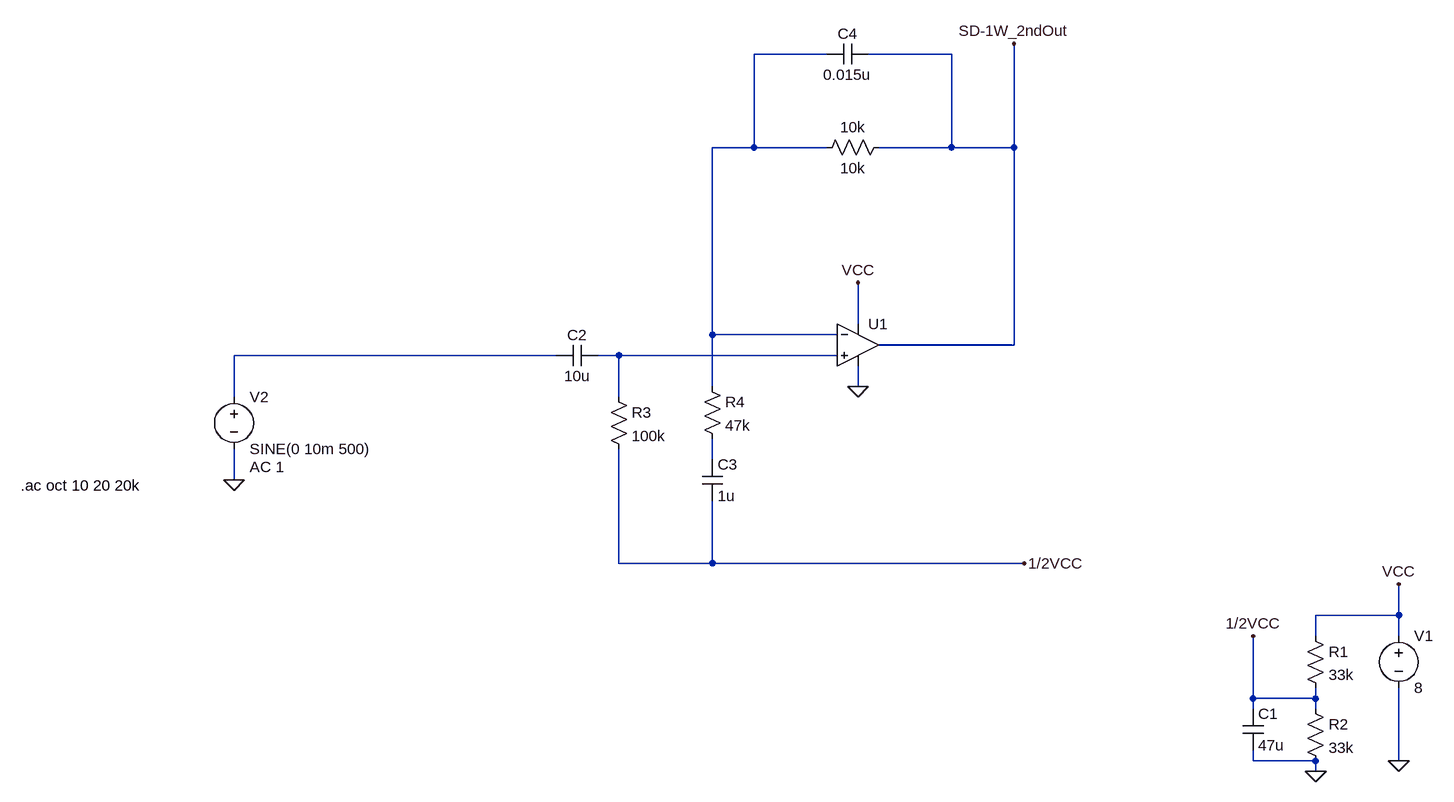
[diagram p0: schematic SD-1_SD-1W_post.asc]
SD-1_SD-1W_post.asc, the LTspice schematic file:
Version 4
SHEET 1 1164 1452
WIRE 224 -288 112 -288
WIRE 416 -288 288 -288
WIRE 112 -144 112 -288
WIRE 112 -144 48 -144
WIRE 224 -144 112 -144
WIRE 416 -144 416 -288
WIRE 416 -144 304 -144
WIRE 512 -144 512 -304
WIRE 512 -144 416 -144
WIRE 272 128 272 64
WIRE 48 144 48 -144
WIRE 240 144 48 144
WIRE 512 160 512 -144
WIRE 512 160 304 160
WIRE -192 176 -688 176
WIRE -96 176 -128 176
WIRE 240 176 -96 176
WIRE 48 224 48 144
WIRE 272 224 272 192
WIRE -688 240 -688 176
WIRE -96 240 -96 176
WIRE 48 336 48 304
WIRE -688 368 -688 320
WIRE -96 496 -96 320
WIRE 48 496 48 400
WIRE 48 496 -96 496
WIRE 528 496 48 496
WIRE 1104 576 1104 528
WIRE 1104 576 976 576
WIRE 976 608 976 576
WIRE 1104 608 1104 576
WIRE 880 704 880 608
WIRE 976 704 976 688
WIRE 976 704 880 704
WIRE 880 720 880 704
WIRE 976 720 976 704
WIRE 880 800 880 784
WIRE 976 800 880 800
WIRE 1104 800 1104 688
WIRE 976 816 976 800
FLAG 1104 800 0
FLAG 1104 528 VCC
FLAG 976 816 0
FLAG 880 608 1/2VCC
FLAG -688 368 0
FLAG 272 224 0
FLAG 272 64 VCC
FLAG 528 496 1/2VCC
FLAG 512 -304 SD-1W_2ndOut
SYMBOL Opamps\\UniversalOpamp2 272 160 R0
SYMATTR InstName U1
SYMBOL voltage 1104 592 R0
WINDOW 123 0 0 Left 2
WINDOW 39 0 0 Left 2
SYMATTR InstName V1
SYMATTR Value 8
SYMBOL res 960 592 R0
SYMATTR InstName R1
SYMATTR Value 33k
SYMBOL res 960 704 R0
SYMATTR InstName R2
SYMATTR Value 33k
SYMBOL cap 864 720 R0
SYMATTR InstName C1
SYMATTR Value 47u
SYMBOL voltage -688 224 R0
WINDOW 123 24 124 Left 2
WINDOW 39 0 0 Left 2
SYMATTR Value2 AC 1
SYMATTR InstName V2
SYMATTR Value SINE(0 10m 500)
SYMBOL res -112 224 R0
SYMATTR InstName R3
SYMATTR Value 100k
SYMBOL cap -128 160 R90
WINDOW 0 0 32 VBottom 2
WINDOW 3 32 32 VTop 2
SYMATTR InstName C2
SYMATTR Value 10u
SYMBOL res 32 208 R0
SYMATTR InstName R4
SYMATTR Value 47k
SYMBOL cap 32 336 R0
SYMATTR InstName C3
SYMATTR Value 1u
SYMBOL cap 288 -304 R90
WINDOW 0 0 32 VBottom 2
WINDOW 3 32 32 VTop 2
SYMATTR InstName C4
SYMATTR Value 0.015u
SYMBOL res 320 -160 R90
WINDOW 0 0 56 VBottom 2
WINDOW 3 32 56 VTop 2
SYMATTR InstName 10k
SYMATTR Value 10k
TEXT -1016 376 Left 2 !.ac oct 10 20 20k

The netlist it stands for:
* SD-1_SD-1W_post.asc
XU1 N003 N001 VCC 0 SD-1W_2ndOut level.2 Avol=1Meg GBW=10Meg Slew=10Meg ilimit=25m rail=0 Vos=0 phimargin=45 en=0 enk=0 in=0 ink=0 Rin=500Meg  ; pins IN+ IN- V+ V- OUT
V1 VCC 0 8
R1 VCC 1/2VCC 33k
R2 1/2VCC 0 33k
C1 1/2VCC 0 47u
V2 N002 0 SINE(0 10m 500) AC 1
R3 N003 1/2VCC 100k
C2 N003 N002 10u
R4 N001 N004 47k
C3 N004 1/2VCC 1u
C4 SD-1W_2ndOut N001 0.015u
R§10k SD-1W_2ndOut N001 10k
.ac oct 10 20 20k
.lib UniversalOpamps2.sub
.backanno
.end